# EAGLE design GC_Arduino (EAGLE 7.1.0)
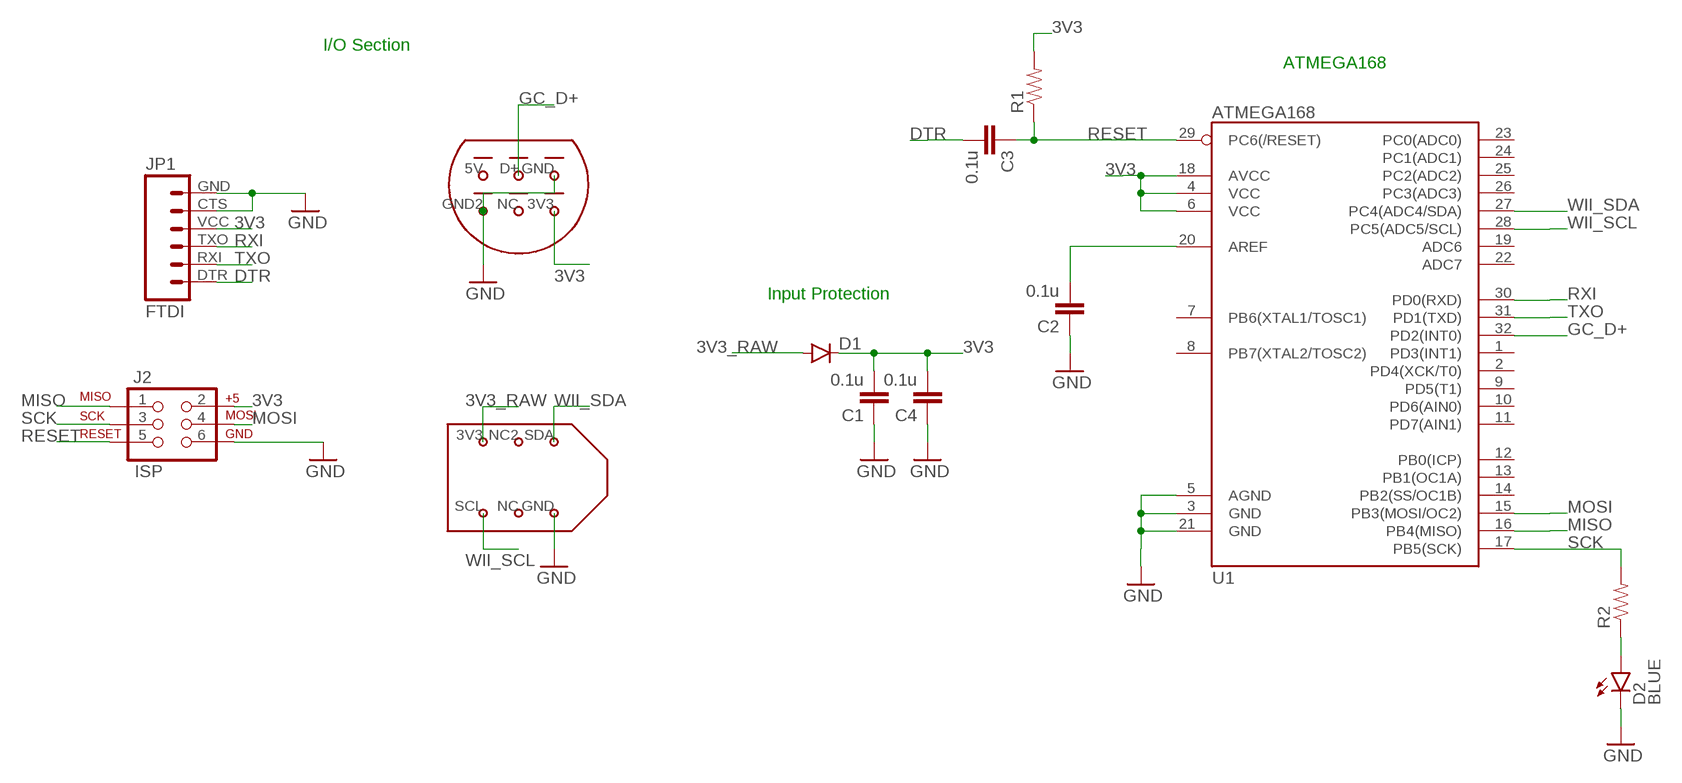
[diagram p0: schematic, sheet 1]

## Parts
C1  0.1u  CAP0603-CAP  [0603-CAP]
C2  0.1u  CAP0603-CAP  [0603-CAP]
C3  0.1u  CAP0603-CAP  [0603-CAP]
C4  0.1u  CAP0603-CAP  [0603-CAP]
D1  DIODESOD523  [SOD523]
D2  BLUE  LED-BLUE0603  [LED-0603]
J1  GC_CONNECTOR  [GC_CONNECTOR]
J2  ISP  AVR_SPI_PRG_6NS  [2X3-NS]
JP1  FTDI  FTDI_BASICPTH  [FTDI_BASIC]
R1  RESISTOR0603-RES  [0603-RES]
R2  RESISTOR0603-RES  [0603-RES]
U1  ATMEGA168  [TQFP32-08]
U$1  WII_CONNECTOR  [WII_CONNECTOR]

## Nets
3V3: C1.2 C4.2 D1.C J1.3V3 J2.2 JP1.VCC R1.2 U1.4(VCC) U1.6(VCC) U1.18(AVCC)
3V3_RAW: D1.A U$1.3V3
DTR: C3.2 JP1.DTR
GC_D+: J1.D+ U1.32(PD2(INT0))
GND: C1.1 C2.1 C4.1 D2.C J1.GND J1.GND2 J2.6 JP1.CTS JP1.GND U1.3(GND) U1.5(AGND) U1.21(GND) U$1.GND
MISO: J2.1 U1.16(PB4(MISO))
MOSI: J2.4 U1.15(PB3(MOSI/OC2))
N$2: C2.2 U1.20(AREF)
N$14: D2.A R2.1
RESET: C3.1 J2.5 R1.1 U1.29(PC6(/RESET))
RXI: JP1.TXO U1.30(PD0(RXD))
SCK: J2.3 R2.2 U1.17(PB5(SCK))
TXO: JP1.RXI U1.31(PD1(TXD))
WII_SCL: U1.28(PC5(ADC5/SCL)) U$1.SCL
WII_SDA: U1.27(PC4(ADC4/SDA)) U$1.SDA
Unconnected: J1.NC U1.1(PD3(INT1)) U1.2(PD4(XCK/T0)) U1.7(PB6(XTAL1/TOSC1)) U1.8(PB7(XTAL2/TOSC2)) U1.9(PD5(T1)) U1.10(PD6(AIN0)) U1.11(PD7(AIN1)) U1.12(PB0(ICP)) U1.13(PB1(OC1A)) U1.14(PB2(SS/OC1B)) U1.19(ADC6) U1.22(ADC7) U1.23(PC0(ADC0)) U1.24(PC1(ADC1)) U1.25(PC2(ADC2)) U1.26(PC3(ADC3)) U$1.NC U$1.NC2

## Notes on the sheet
- I/O Section
- ATMEGA168
- Input Protection

## Power pins joined to a net without a drawn wire
1: J1.5V

## Library data of the parts
C1-C4 = SparkFun-Passives:CAP: Capacitor Standard 0603 ceramic capacitor, and 0.1" leaded capacitor.
D1 = SparkFun-DiscreteSemi:DIODE: Diode These are standard reverse protection diodes and small signal diodes. SMA package can handle up to about 1A. SOD-323 can handle about 200mA. What the SOD-323 package when ordering, there are some mfgs out there that are 5-pin packages.
D2 = SparkFun-LED:LED-BLUE: Blue LEDs for production use Various blue LEDs stocked by SparkFun production 0603 - DIO-08575 Rebel - DIO-09553 1206 - DIO-09911; PROD_ID: DIO-08575
J1 = GCLib:GC_CONNECTOR
J2 = SparkFun-Connectors:AVR_SPI_PRG_6: AVR ISP 6 Pin This is the reduced ISP connector for AVR programming. Common on Arduino. This footprint will take up less PCB space and can be used with a 10-pin to 6-pin adapter such as SKU: BOB-08508 **Special note about "TEST_POINT" package. The stop mask is on the top side, so if you want your programming test points to be on the bottom of your board, make sure to place this package on the bottom side of the board. This also ensure that the orientation to program from the bottom side will be correct.
JP1 = SparkFun-Connectors:FTDI_BASIC: FTDI Basic header with labels
R1 R2 = SparkFun-Passives:RESISTOR: Resistor Basic schematic elements and footprints for 0603, 1206, and PTH resistors.
U1 = SparkFun-DigitalIC:ATMEGA168: Atmel 32-pin 8-bit micro, 16k flash.
U$1 = GCLib:WII_CONNECTOR

## Board
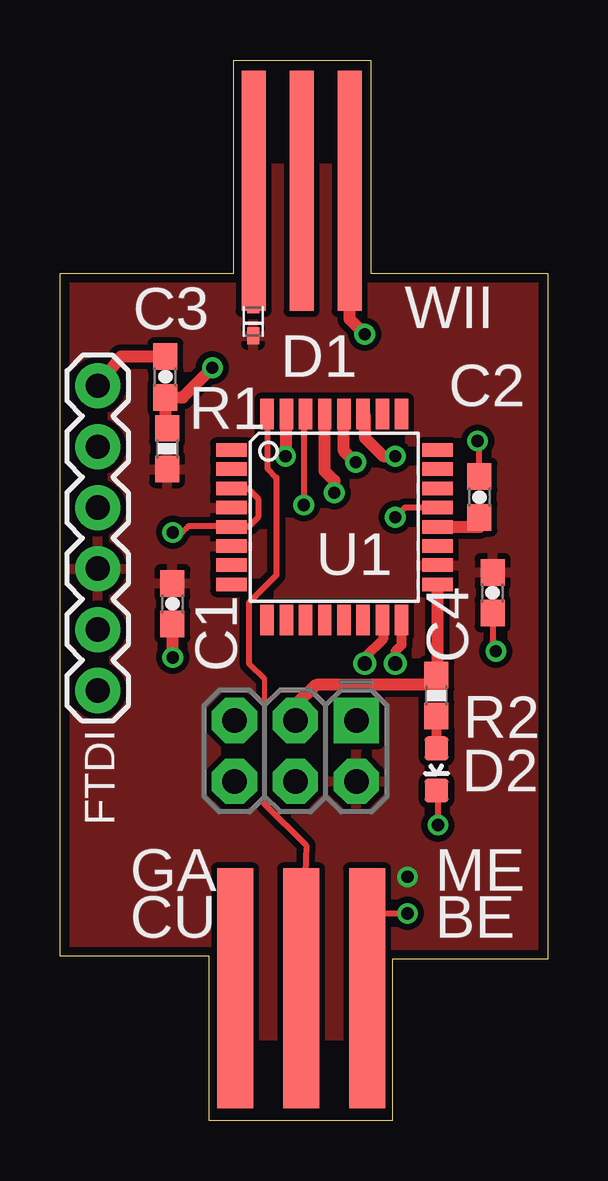
[diagram p1: board, top side]
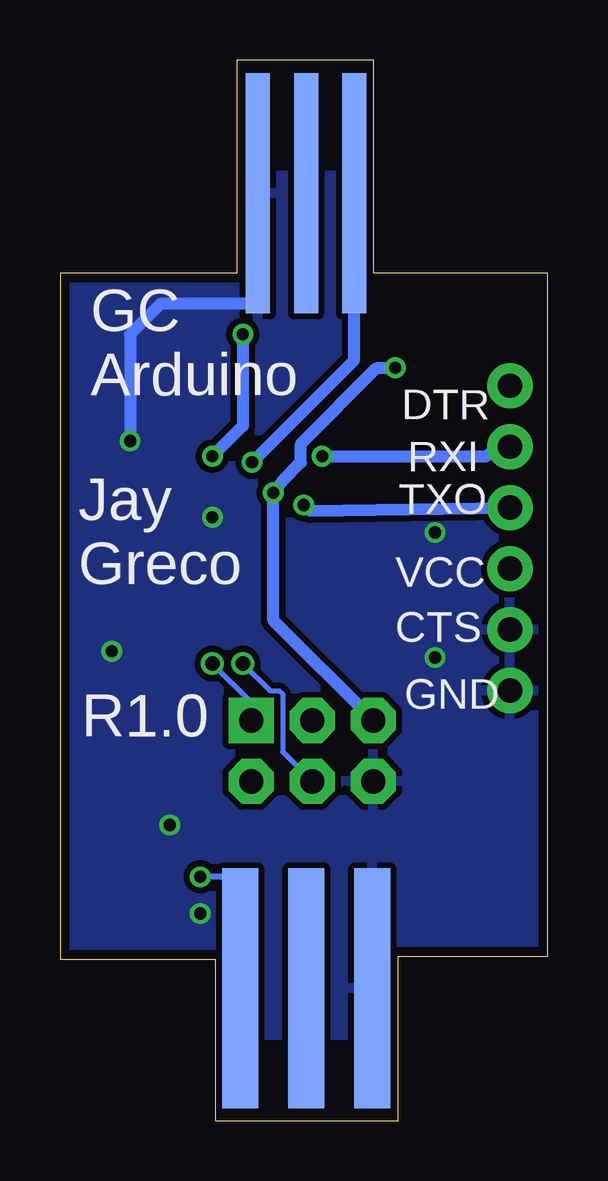
[diagram p2: board, bottom side, seen from below]

Size 20.32 x 44.2 mm. Coordinates in mm from the lower left corner, seen from the top.
Outline: 6.22,0 6.22,6.86 0,6.86 0,35.31 7.24,35.31 7.24,44.2 12.95,44.2 12.95,35.31 20.32,35.31 20.32,6.73 13.84,6.73 13.84,0 6.22,0
Copper layers (1*16): Top 0.0356mm / dielectric 1.5011mm / Bottom 0.0356mm
Design rules "OSHPark": minimum track width 6mil, minimum drill 13mil, track to track 6mil, track to pad 6mil, pad to pad 6mil, via to via 6mil, smd to smd 6mil, copper to edge 15mil, drill to drill 6mil, minimum pad ring 7mil, minimum via ring 7mil, stop-mask expansion 3mil, vias tented up to drill 0mil, thermal gap 10mil

### Footprints (pad centres in the part's own frame; a part is rotated, then mirrored left to right if it is on the bottom)
0603-CAP = smd 1.1 x 1: 1 -0.85,0; 2 0.85,0
SOD523 = smd 0.7 x 0.5: A 0.7,0; C -0.6,0
LED-0603 = smd 1 x 1: A 0,-0.877; C 0,0.877
GC_CONNECTOR = smd 1.5 x 10 bottom: 3V3 6.25,5.5; GND2 0.75,5.5; NC 3.5,5.5 | smd 1.5 x 10: 5V 0.75,5.5; D+ 3.5,5.5; GND 6.25,5.5
2X3-NS = drill 1.016 pad 1.88 square: 1 -2.54,-1.27 | drill 1.016 pad 1.88 octagon: 2 -2.54,1.27; 3 0,-1.27; 4 0,1.27; 5 2.54,-1.27; 6 2.54,1.27
FTDI_BASIC = drill 1.016 pad 1.88: CTS 10.16,0; DTR 0,0; GND 12.7,0; RXI 2.54,0; TXO 5.08,0; VCC 7.62,0
0603-RES = smd 1.1 x 1: 1 -0.85,0; 2 0.85,0
TQFP32-08 = smd 1.27 x 0.559: 1 -4.293,2.8; 2 -4.293,2; 3 -4.293,1.2; 4 -4.293,0.4; 5 -4.293,-0.4; 6 -4.293,-1.2; 7 -4.293,-2; 8 -4.293,-2.8; 17 4.293,-2.8; 18 4.293,-2; 19 4.293,-1.2; 20 4.293,-0.4; 21 4.293,0.4; 22 4.293,1.2; 23 4.293,2; 24 4.293,2.8 | smd 0.559 x 1.27: 9 -2.8,-4.293; 10 -2,-4.293; 11 -1.2,-4.293; 12 -0.4,-4.293; 13 0.4,-4.293; 14 1.2,-4.293; 15 2,-4.293; 16 2.8,-4.293; 25 2.8,4.293; 26 2,4.293; 27 1.2,4.293; 28 0.4,4.293; 29 -0.4,4.293; 30 -1.2,4.293; 31 -2,4.293; 32 -2.8,4.293
WII_CONNECTOR = smd 1 x 10: 3V3 0.5,5.6; NC2 2.5,5.6; SDA 4.5,5.6 | smd 1 x 10 bottom: GND 4.51,5.5; NC 2.5,5.5; SCL 0.5,5.5

### Placement (x,y rotation side)
C1  4.69,21.54 90 top
C2  17.48,25.99 270 top
C3  4.39,30.99 90 top
C4  18.03,22 90 top
D1  8.05,33.3 90 top
D2  15.69,14.64 180 top
J1  6.55,0.02 0 top
J2  9.81,15.41 180 top
JP1  1.57,30.62 270 top
R1  4.46,28 270 top
R2  15.69,17.72 90 top
U1  11.43,25.15 0 top
U$1  7.57,33.14 0 top

### Tracks (layer width: path | path; a pad name or v marks a point on that pad's centre or on a via)
3V3  (via drill 0.51)
  Bottom 0.254: J1.3V3 12.95,5.71 12.95,9.53 13.59,10.16 v14.48,10.16
  pour Top (isolate 0.254): 0,3.56 20.22,3.56 20.22,39.67 0,39.67
3V3_RAW
  Top 0.508: D1.A 8.06,34.02 U$1.3V3
DTR
  Top 0.508: C3.2 2.53,31.84 JP1.DTR
GC_D+
  Top 0.203: U1.32 | 8.51,18.41 8.51,13.21
  Top 0.254: 8.51,18.41 7.87,19.05 7.87,21.59 9.02,22.73 9.02,26.8 8.64,27.18 U1.32 | 8.51,13.21 10.25,11.47 J1.D+
GND  (via drill 0.51)
  Top 0.254: U1.21 14.37,25.55 v13.97,25.15 | C2.1 17.48,28.24 v17.4,28.32 | C4.1 18.03,19.94 v18.16,19.56 | U1.3 7.82,26.35 8.26,25.91 8.26,25.15 7.86,24.75 U1.5 7.03,24.64 6.9,24.76 5.33,24.76 5.08,24.51 v4.7,24.51 | D2.C 15.75,13.7 v15.75,12.32 | J1.GND 12.7,5.58 12.7,8.76 12.83,8.64 v14.48,8.64
  Top 0.508: C1.1 4.69,19.32 v4.7,19.3
  Bottom 0.508: U$1.GND 12.19,38.53 12.19,34.04 16.13,34.04 17.4,32.77 v17.4,28.32
  pour Bottom (isolate 0.254): 0,39.4 0,3.56 20.22,3.56 20.22,39.4
MISO  (via drill 0.6)
  Top 0.406: U1.16 14.22,19.81 13.97,19.56 v13.97,19.05
  Bottom 0.203: v13.97,19.05 12.35,17.43 J2.1
MOSI  (via drill 0.6)
  Top 0.406: U1.15 13.46,20.82 13.46,20.07 12.7,19.3 v12.7,19.05
  Bottom 0.203: v12.7,19.05 11.56,17.91 11.18,17.91 11.05,17.78 11.05,15.37 J2.4
N$2
  Top 0.406: 17.47,24.75 C2.2
  Top 0.508: U1.20 17.47,24.75
N$14
  Top 0.406: R2.1 D2.A
RESET  (via drill 0.51)
  Top 0.203: 11.03,29.99 U1.29
  Top 0.508: U1.29 11.03,27.07 11.43,26.67 v11.43,26.16 | v6.35,31.37 5.12,30.14 C3.1 4.39,28.93 R1.1
  Bottom 0.508: J2.5 11.43,20.84 v11.43,26.16 11.05,26.67 10.29,27.43 10.29,28.19 7.11,31.37 v6.35,31.37
RXI  (via drill 0.51)
  Top 0.203: U1.30 10.16,29.37
  Top 0.254: 10.16,29.37 v10.16,25.65
  Bottom 0.508: v10.16,25.65 9.92,25.42 JP1.TXO
SCK
  Top 0.203: R2.2 15.91,18.16
  Top 0.508: U1.17 15.72,19.24 R2.2 | 15.91,18.16 10.67,18.16 9.81,17.3 J2.3
TXO  (via drill 0.51)
  Top 0.203: U1.31 9.4,29.41
  Top 0.508: 9.4,29.41 v9.4,27.69
  Bottom 0.508: v9.4,27.69 2.54,27.69 2.27,27.96 JP1.RXI
WII_SCL  (via drill 0.51)
  Top 0.508: U1.28 11.81,29.42 11.81,27.94 v12.32,27.43
  Bottom 0.508: v12.32,27.43 8.06,31.69 U$1.SCL
WII_SDA  (via drill 0.51)
  Top 0.508: U1.27 12.7,29.37 12.7,28.45 13.46,27.69 v13.97,27.69 | v12.7,32.77 12.06,33.4 U$1.SDA
  Bottom 0.508: v12.7,32.77 12.7,28.96 v13.97,27.69

### Text on the board
tPlace: WII | FTDI | GA / CU | ME / BE
bPlace: GC / Arduino | DTR | RXI | TXO | Jay / Greco | VCC | CTS | GND | R1.0